# EAGLE design lcd13264-module-example (EAGLE 6.5.0)
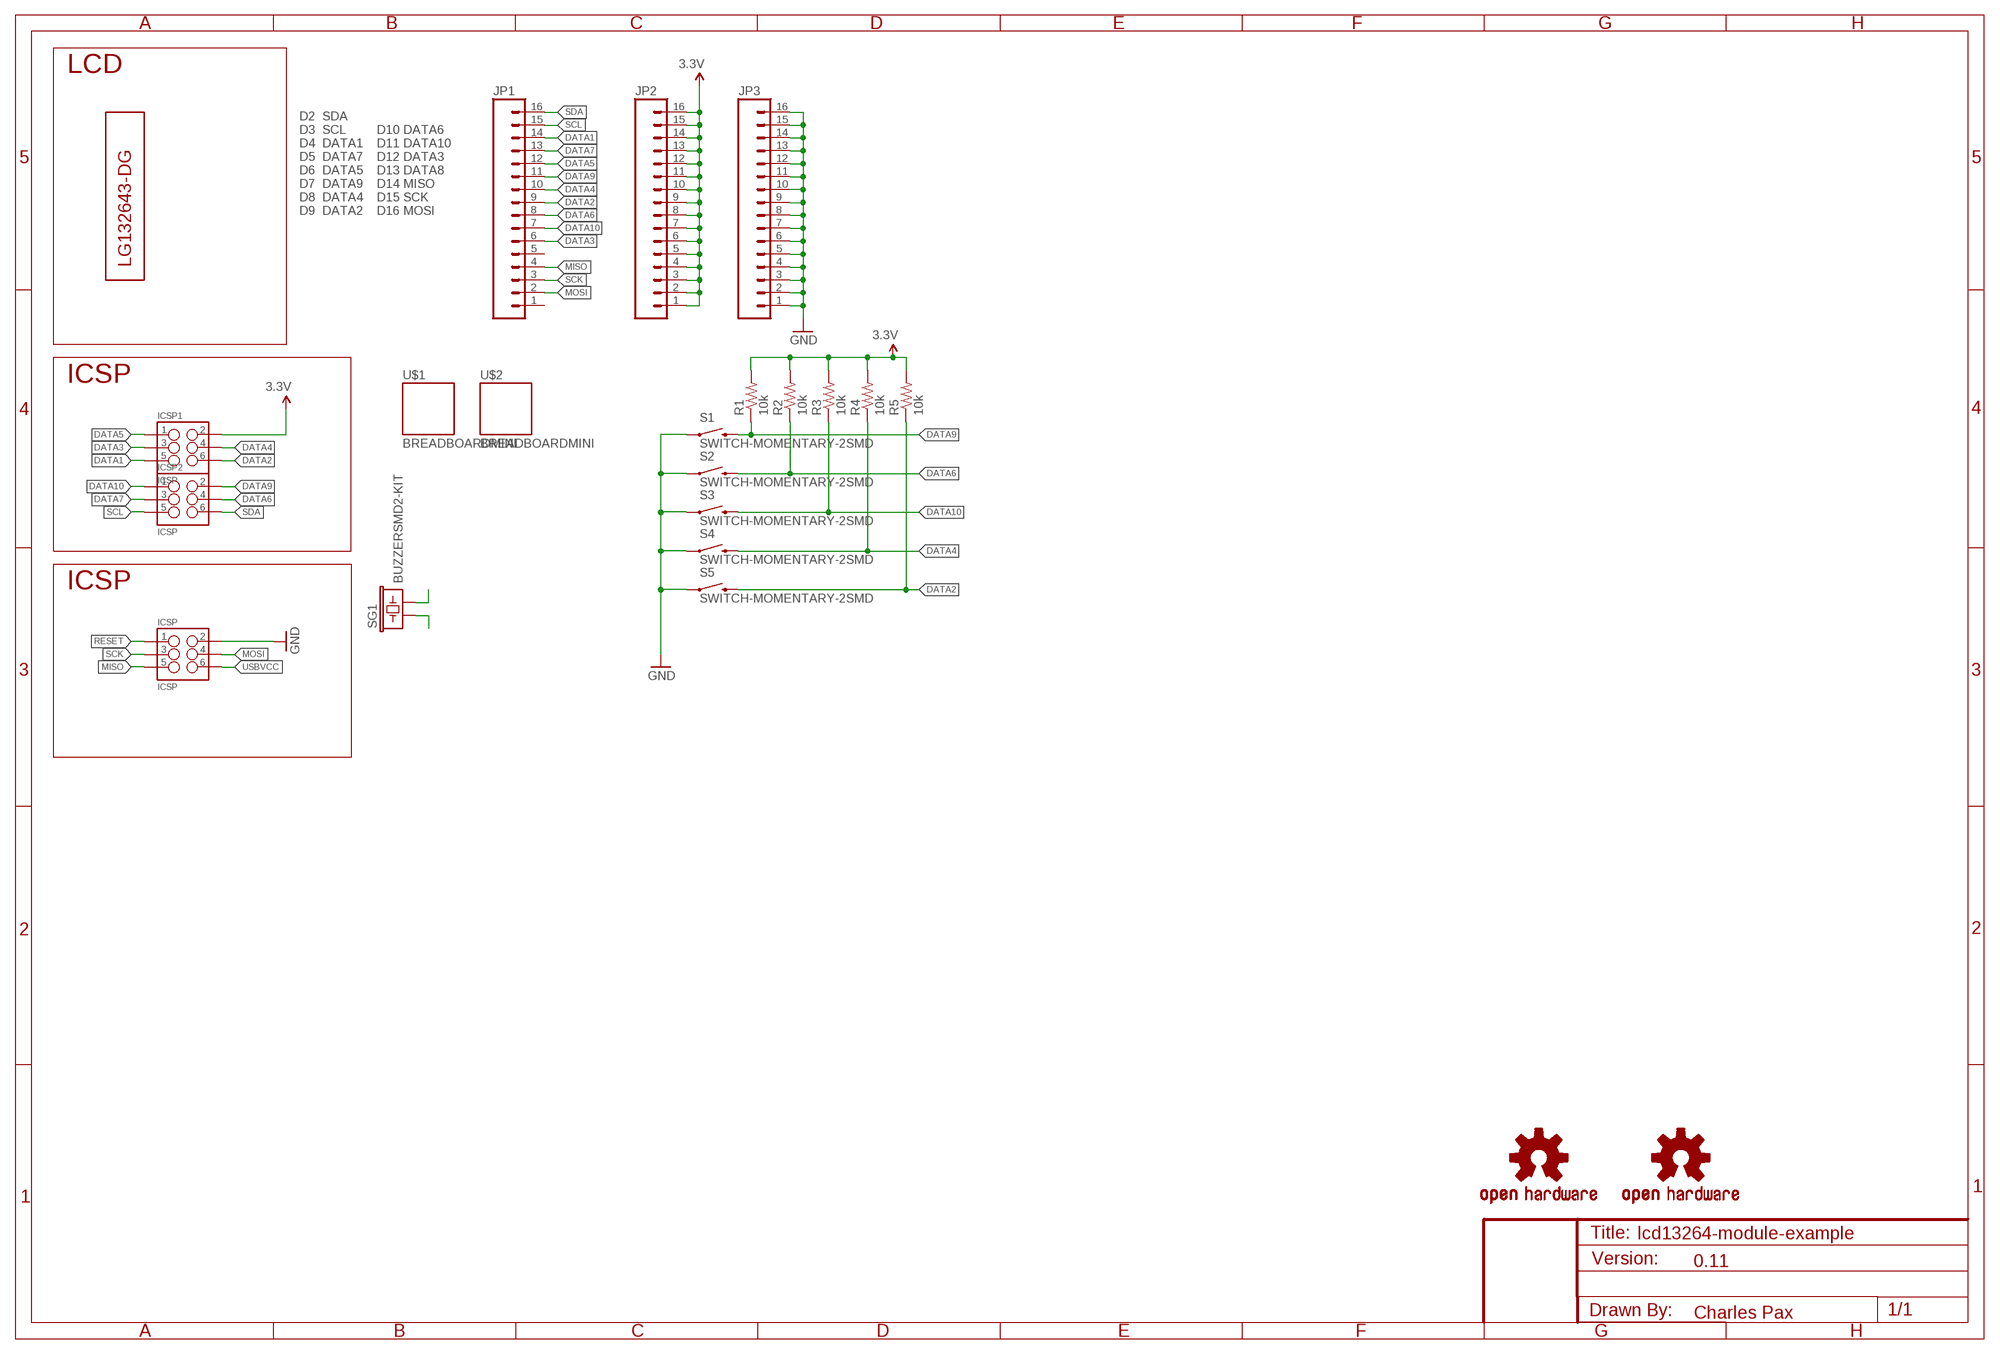
[diagram p0: schematic, sheet 1]

## Parts
ICSP  ICSP  SPARKFUN-CONNECTORS_M03X2PAX  [SPARKFUN-CONNECTORS_2X3_SMT_POSTS_PAXINSTRUMENT]
ICSP1  ICSP  SPARKFUN-CONNECTORS_M03X2PAX  [SPARKFUN-CONNECTORS_2X3_SMT_POSTS_PAXINSTRUMENT]
ICSP2  ICSP  SPARKFUN-CONNECTORS_M03X2PAX  [SPARKFUN-CONNECTORS_2X3_SMT_POSTS_PAXINSTRUMENT]
JP1  M161X16_NO_SILK  [1X16_NO_SILK]
JP2  M161X16_NO_SILK  [1X16_NO_SILK]
JP3  M161X16_NO_SILK  [1X16_NO_SILK]
LOGO1  OSHW-LOGOL  [OSHW-LOGO-L]
LOGO2  OSHW-LOGOL-COPPER  [OSHW-LOGO-L_COPPER]
R1  10k  RESISTOR0603-RES  [0603-RES]
R2  10k  RESISTOR0603-RES  [0603-RES]
R3  10k  RESISTOR0603-RES  [0603-RES]
R4  10k  RESISTOR0603-RES  [0603-RES]
R5  10k  RESISTOR0603-RES  [0603-RES]
S1  SWITCH-MOMENTARY-2SMD  [TACTILE-SWITCH-SMD]
S2  SWITCH-MOMENTARY-2SMD  [TACTILE-SWITCH-SMD]
S3  SWITCH-MOMENTARY-2SMD  [TACTILE-SWITCH-SMD]
S4  SWITCH-MOMENTARY-2SMD  [TACTILE-SWITCH-SMD]
S5  SWITCH-MOMENTARY-2SMD  [TACTILE-SWITCH-SMD]
SG1  BUZZERSMD2-KIT  [BUZZER-CCV-KIT]
U$1  BREADBOARDMINI  [BREADBOARD-MINI]
U$2  BREADBOARDMINI  [BREADBOARD-MINI]
U$5  LG132643-DG  [LG132643-DG]

## Nets
3.3V: ICSP1.2 JP2.1 JP2.2 JP2.3 JP2.4 JP2.5 JP2.6 JP2.7 JP2.8 JP2.9 JP2.10 JP2.11 JP2.12 JP2.13 JP2.14 JP2.15 JP2.16 R1.2 R2.2 R3.2 R4.2 R5.2
DATA1: ICSP1.5 JP1.14
DATA2: ICSP1.6 JP1.9 R5.1 S5.3
DATA3: ICSP1.3 JP1.6
DATA4: ICSP1.4 JP1.10 R4.1 S4.3
DATA5: ICSP1.1 JP1.12
DATA6: ICSP2.4 JP1.8 R2.1 S2.3
DATA7: ICSP2.3 JP1.13
DATA9: ICSP2.2 JP1.11 R1.1 S1.3
DATA10: ICSP2.1 JP1.7 R3.1 S3.3
GND: ICSP.2 JP3.1 JP3.2 JP3.3 JP3.4 JP3.5 JP3.6 JP3.7 JP3.8 JP3.9 JP3.10 JP3.11 JP3.12 JP3.13 JP3.14 JP3.15 JP3.16 S1.1 S2.1 S3.1 S4.1 S5.1
MISO: ICSP.5 JP1.4
MOSI: ICSP.4 JP1.2
N$1: SG1.+
N$2: SG1.-
RESET: ICSP.1
SCK: ICSP.3 JP1.3
SCL: ICSP2.5 JP1.15
SDA: ICSP2.6 JP1.16
USBVCC: ICSP.6
Unconnected: JP1.1 JP1.5

## Notes on the sheet
- LCD
- D2  SDA
  D3  SCL
  D4  DATA1
  D5  DATA7
  D6  DATA5
  D7  DATA9
  D8  DATA4
  D9  DATA2
- D10 DATA6
  D11 DATA10
  D12 DATA3
  D13 DATA8
  D14 MISO
  D15 SCK
  D16 MOSI
- ICSP
- ICSP
- 0.11
- Charles Pax

## Library data of the parts
ICSP ICSP1 ICSP2 = PaxInstrument-T400:SPARKFUN-CONNECTORS_M03X2: 2x3 .1" header. Shrouded, with keying- CONN-10681 SMT- CONN-11415 Pogo pins- HW-11044; MPN: 95278-101A06LF; OC_DIGIKEY: 609-3487-2-ND
JP1-JP3 = SparkFun-Connectors:M16: 1x16 .1" header
LOGO1 LOGO2 = SparkFun-Aesthetics:OSHW-LOGO: Open Source Hardware Logo This logo indicates the piece of hardware it is found on incorporates a OSHW license and/or adheres to the definition of open source hardware found here: http://freedomdefined.org/OSHW
R1-R5 = SparkFun-Passives:RESISTOR: Resistor Basic schematic elements and footprints for 0603, 1206, and PTH resistors.
S1-S5 = SparkFun-Electromechanical:SWITCH-MOMENTARY-2: Various NO switches- pushbuttons, reed, etc; PROD_ID: SWCH-08247
SG1 = SparkFun-Electromechanical:BUZZER: Buzzer 12mm Spark Fun Electronics SKU : Comp-Buzzer
U$1 U$2 = SparkFun-Boards:BREADBOARD: Breadboard Mini Self Adhesive This is the mechnical outline for the very small self adhesive breadboard from SparkFun Electronics. Good for very small proto areas. SKU : PRT-07916
U$5 = charlespax:LG132643-DG; MPN: LG132643-DW

## Net classes
0 default: width 0.203 mm, drill 0.33 mm
1 power: width 0.305 mm

## Board
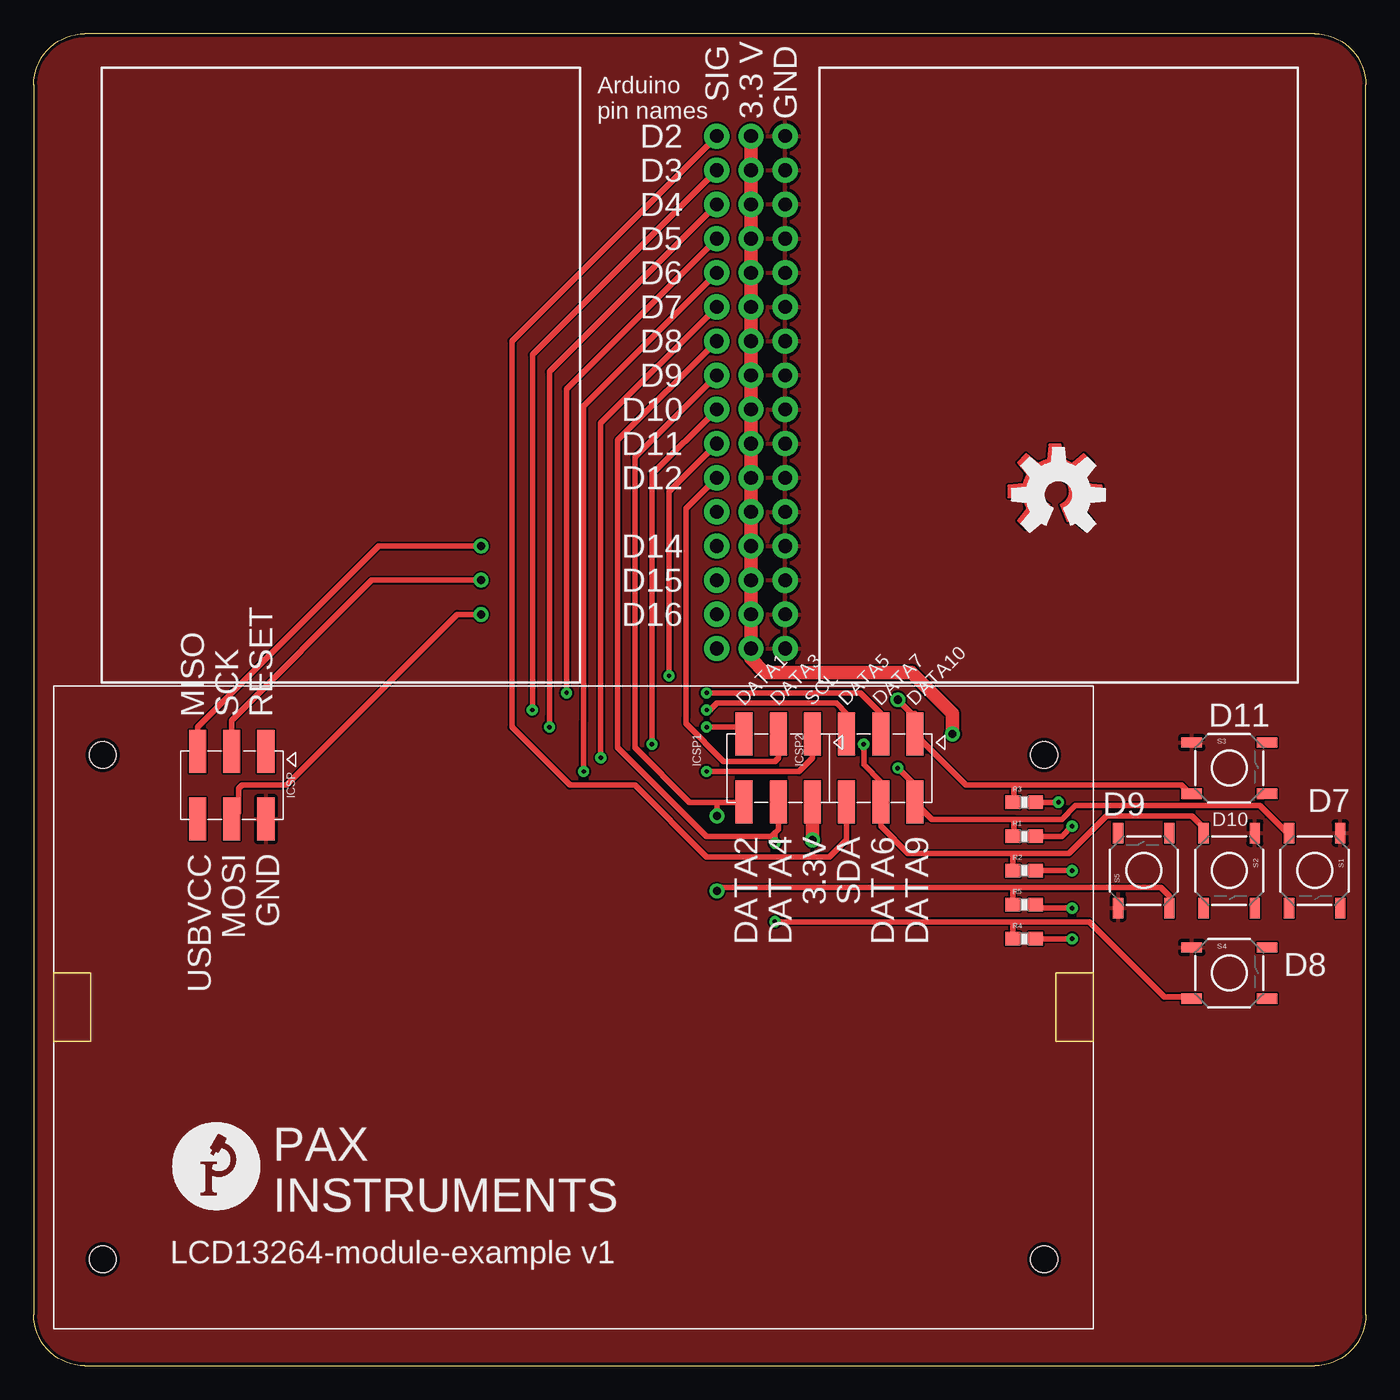
[diagram p1: board, top side]
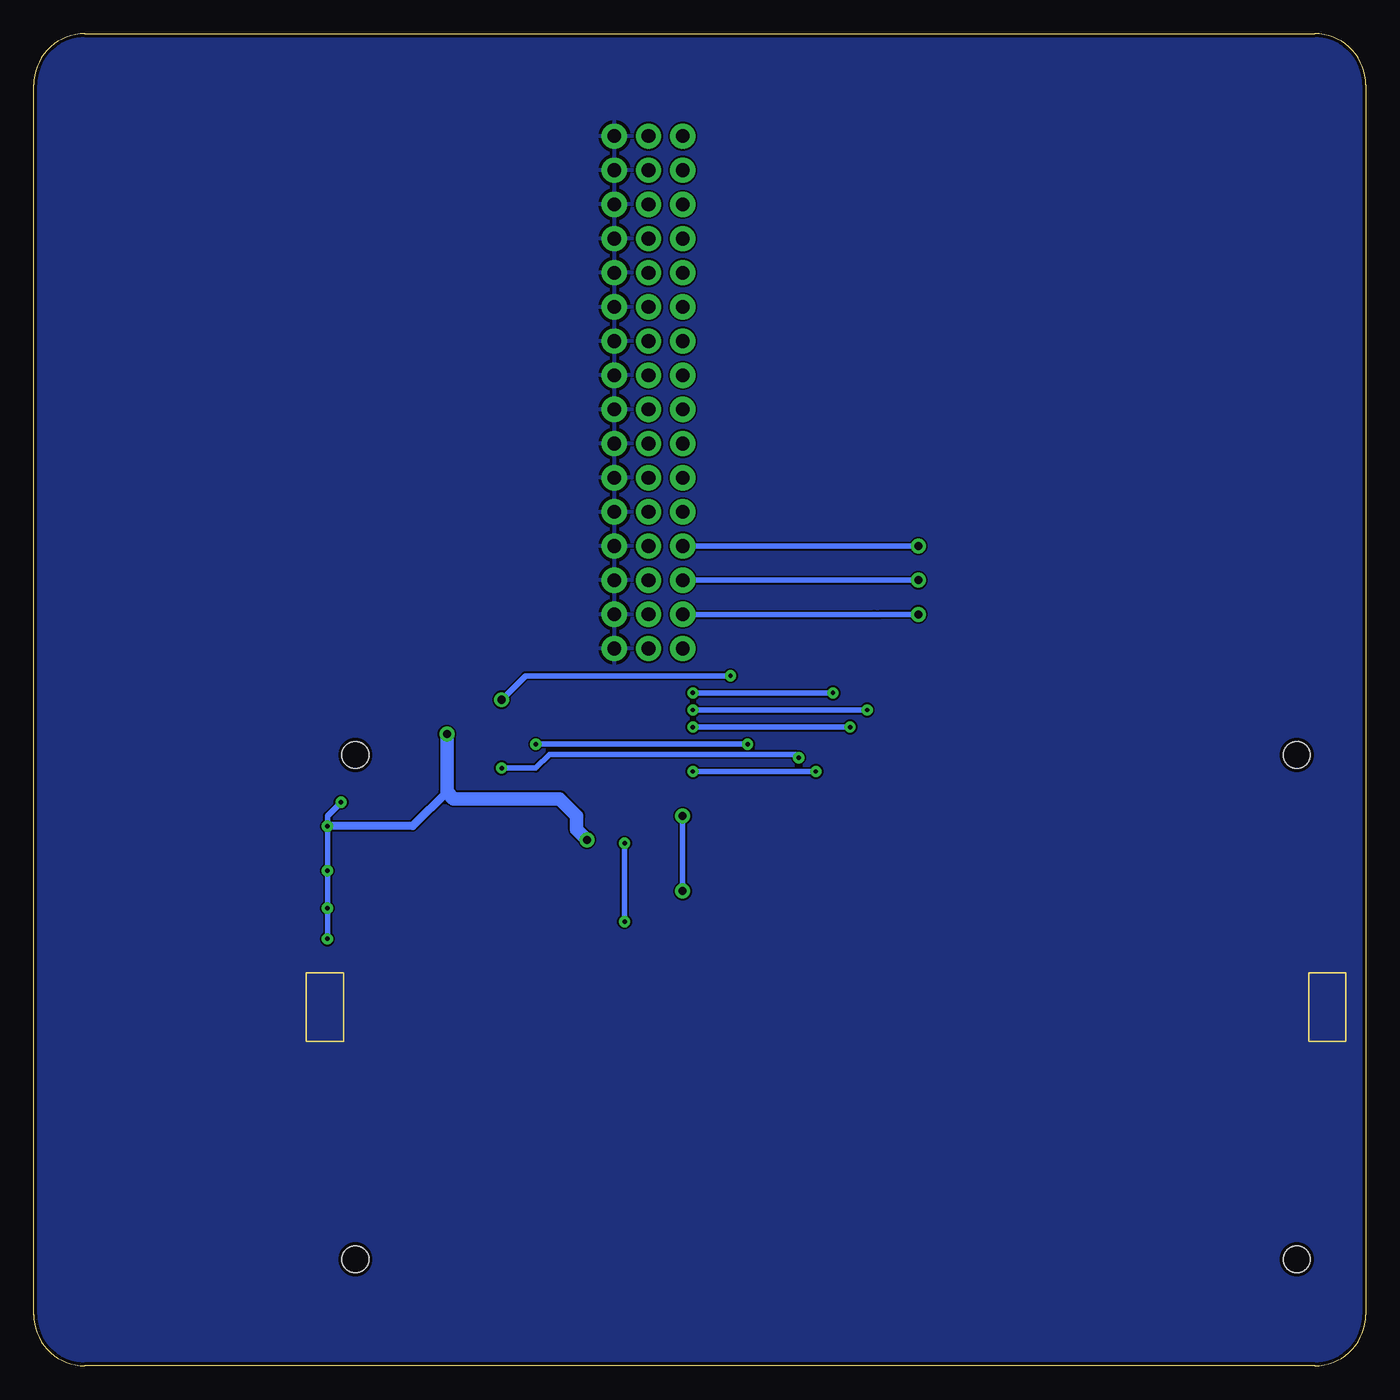
[diagram p2: board, bottom side, seen from below]

Size 99.06 x 99.06 mm. Coordinates in mm from the lower left corner, seen from the top.
Outline: 3.81,0 95.25,0 arc90 99.06,3.81 99.06,95.25 arc90 95.25,99.06 3.81,99.06 arc90 0,95.25 0,3.81 arc90 3.81,0
Copper layers (1*16): Top 0.035mm / dielectric 1.5mm / Bottom 0.035mm
Design rules "PaxInstrument-T400 *": minimum track width 6mil, minimum drill 13mil, track to track 5mil, track to pad 5mil, pad to pad 5mil, via to via 5mil, smd to smd 5mil, copper to edge 10mil, drill to drill 8mil, minimum pad ring 12mil, minimum via ring 10mil, stop-mask expansion 4mil, vias tented up to drill 25mil, thermal gap 10mil
vRestrict: area 1.3,2.5 to 78.7,50.8

### Footprints (pad centres in the part's own frame; a part is rotated, then mirrored left to right if it is on the bottom)
SPARKFUN-CONNECTORS_2X3_SMT_POSTS_PAXINSTRUMENT = smd 1.27 x 3.2: 1 -2.54,-2.52; 2 -2.54,2.52; 3 0,-2.52; 4 0,2.52; 5 2.54,-2.52; 6 2.54,2.52
1X16_NO_SILK = drill 1.016 pad 1.88: 1 0,0; 2 2.54,0; 3 5.08,0; 4 7.62,0; 5 10.16,0; 6 12.7,0; 7 15.24,0; 8 17.78,0; 9 20.32,0; 10 22.86,0; 11 25.4,0; 12 27.94,0; 13 30.48,0; 14 33.02,0; 15 35.56,0; 16 38.1,0
0603-RES = smd 1.1 x 1: 1 -0.85,0; 2 0.85,0
TACTILE-SWITCH-SMD = smd 1.524 x 0.762: 1 -2.794,1.905; 2 2.794,1.905; 3 -2.794,-1.905; 4 2.794,-1.905
BUZZER-CCV-KIT = smd 3.5 x 2: + 4.15,0; - -4.15,0 | hole 0.8: -3.9,-2.25; 2.25,3.9
LG132643-DG = hole 2: -35,-18.75; 35,-18.75; 35,18.75; -35,18.75

### Placement (x,y rotation side)
ICSP  14.73,43.18 180 top
ICSP1  55.37,44.45 180 top
ICSP2  62.99,44.45 180 top
JP1  50.8,53.34 90 top
JP2  53.34,53.34 90 top
JP3  55.88,53.34 90 top
LOGO1  76.2,64.77 0 top
LOGO2  75.95,65.02 0 top
R1  73.66,39.37 0 top
R2  73.66,36.83 0 top
R3  73.66,41.91 0 top
R4  73.66,31.75 0 top
R5  73.66,34.29 0 top
S1  95.25,36.83 270 top
S2  88.9,36.83 270 top
S3  88.9,44.45 0 top
S4  88.9,29.21 0 top
S5  82.55,36.83 90 top
SG1  -4.32,-17.27 0 top  (outside the outline)
U$1  93.98,50.8 90 top
U$2  40.64,50.8 90 top
U$5  40.13,26.67 0 bottom
U$6  [PAXINSTRUMENT_LOGO]  10.16,11.43 0 top

### Tracks (layer width: path | path; a pad name or v marks a point on that pad's centre or on a via)
3.3V  (via drill 0.33, 0.6)
  Top 0.406: v77.22,40.13 76.45,39.37 R1.2 | v77.22,34.04 74.76,34.04 R5.2 | R2.2 v77.22,36.83 | v77.22,31.75 R4.2 | R3.2 v76.2,41.91
  Top 1.016: JP2.16 JP2.15 JP2.14 JP2.13 JP2.12 JP2.11 JP2.10 JP2.9 JP2.8 JP2.7 JP2.6 JP2.5 JP2.4 JP2.3 JP2.2 JP2.1 53.34,52.58 54.36,51.56 65.28,51.56 68.33,48.51 v68.33,46.99 | ICSP1.2 v57.91,39.12
  Bottom 0.406: v77.22,31.75 v77.22,34.04 v77.22,36.83 v77.22,40.13 77.22,40.89 v76.2,41.91
  Bottom 0.61: 68.33,42.67 70.87,40.13 v77.22,40.13
  Bottom 1.016: v57.91,39.12 58.67,39.88 58.67,40.89 59.94,42.16 67.82,42.16 68.33,42.67 v68.33,46.99
DATA1  (via drill 0.33)
  Top 0.406: JP1.14 38.35,73.91 38.35,48.26 38.35,48.01 v38.35,47.5 | ICSP1.5 52.3,47.5 v50.04,47.5
  Bottom 0.406: v50.04,47.5 v38.35,47.5
DATA2  (via drill 0.6)
  Top 0.406: JP1.9 44.7,67.56 44.7,45.97 48.77,41.91 50.8,41.91 | ICSP1.6 52.81,41.91 50.8,41.91 | 50.8,41.91 v50.8,40.89 | v50.8,35.31 51.05,35.56 72.9,35.56 | 72.9,35.56 83.82,35.56 84.45,34.92 S5.3 | R5.1 72.81,35.47 72.9,35.56
  Bottom 0.406: v50.8,40.89 v50.8,35.31
DATA3
  Top 0.406: JP1.6 48.51,63.75 48.51,48.77 48.51,48.26 48.51,47.75 51.31,44.96 55.12,44.96 55.37,45.21 ICSP1.3
DATA4  (via drill 0.33)
  Top 0.406: JP1.10 43.43,68.83 43.43,45.97 50.04,39.37 54.86,39.37 54.99,39.5 | ICSP1.4 55.37,39.88 54.99,39.5 | R4.1 72.81,33.02 | 72.81,33.02 v55.12,33.02 | v55.12,38.86 55.12,39.5 54.99,39.5 | S4.3 85.98,27.43 84.07,27.43 78.49,33.02 72.81,33.02
  Bottom 0.406: v55.12,33.02 v55.12,38.86
DATA5  (via drill 0.33)
  Top 0.406: JP1.12 40.89,71.37 40.89,48.26 40.89,48.01 v40.89,44.2 | ICSP1.1 57.91,45.21 56.9,44.2 v50.04,44.2
  Bottom 0.406: v50.04,44.2 v40.89,44.2
DATA6  (via drill 0.33)
  Top 0.406: JP1.8 45.97,66.29 v45.97,46.23 | v61.72,46.23 61.72,44.7 62.99,43.43 ICSP2.4 62.99,40.13 65.02,38.1 72.9,38.1 | 72.9,38.1 76.96,38.1 79.76,40.89 86.11,40.89 87,40.01 S2.3 | R2.1 72.81,38.01 72.9,38.1
  Bottom 0.406: v45.97,46.23 v61.72,46.23
DATA7  (via drill 0.33)
  Top 0.406: JP1.13 39.62,72.64 v39.62,50.04 | ICSP2.3 62.99,48.51 61.47,50.04 v50.04,50.04
  Bottom 0.406: v50.04,50.04 v39.62,50.04
DATA9  (via drill 0.33)
  Top 0.406: JP1.11 42.16,70.1 v42.16,45.21 | v64.26,44.45 65.53,43.18 ICSP2.2 | ICSP2.2 65.81,41.66 | S1.3 93.22,39.62 91.19,41.66 77.47,41.66 76.45,40.64 72.9,40.64 | R1.1 72.9,39.46 72.9,40.64 | 72.9,40.64 66.8,40.64 65.53,41.91 ICSP2.2
  Bottom 0.406: v42.16,45.21 42.42,45.47 60.71,45.47 61.72,44.45 v64.26,44.45
DATA10  (via drill 0.33, 0.6)
  Top 0.406: JP1.7 47.24,65.02 v47.24,51.31 | 65.53,48.26 65.53,48.51 | v64.26,49.53 65.53,48.26 | 65.53,48.26 ICSP2.1 69.32,43.18 72.9,43.18 | 72.9,43.18 85.34,43.18 85.98,42.55 S3.3 | R3.1 72.9,42 72.9,43.18
  Bottom 0.406: v47.24,51.31 62.48,51.31 v64.26,49.53
GND
  pour Top: 0,99.06 0,0 99.06,0 99.06,99.06
  pour Bottom: 0,99.06 0,0 99.06,0 99.06,99.06
MISO  (via drill 0.6)
  Top 0.406: ICSP.5 12.19,47.5 25.65,60.96 v33.27,60.96
  Bottom 0.406: JP1.4 v33.27,60.96
MOSI  (via drill 0.6)
  Top 0.406: ICSP.4 15.24,41.17 15.24,42.93 15.49,43.18 18.8,43.18 31.5,55.88 v33.27,55.88
  Bottom 0.406: JP1.2 36.58,55.88 36.07,55.88 v33.27,55.88
SCK  (via drill 0.6)
  Top 0.406: v33.27,58.42 28.19,58.42 27.45,58.42 25.15,58.42 14.73,48.01 ICSP.3
  Bottom 0.406: JP1.3 v33.27,58.42
SCL  (via drill 0.33)
  Top 0.406: JP1.15 37.08,75.18 v37.08,48.77 | ICSP2.5 60.45,48.51 59.69,49.28 50.8,49.28 50.29,48.77 v50.04,48.77
  Bottom 0.406: v50.04,48.77 v37.08,48.77
SDA
  Top 0.406: JP1.16 35.56,76.2 35.56,47.5 39.88,43.18 44.7,43.18 50.04,37.85 59.18,37.85 60.45,39.12 ICSP2.6

### Text on the board
tPlace: SIG | Arduino / pin names | 3.3 V | GND | D2 | D3 | D4 | D5 | D6 | D7 | D8 | D9 | D10 | D11 | D12 | D14 | D15 | D16 | DATA1 | DATA3 | SCL | DATA5 | DATA7 | DATA10 | MISO | SCK | RESET | D11 | D9 | D7 | D10 | DATA2 | DATA4 | 3.3V | SDA | DATA6 | DATA9 | USBVCC | MOSI | GND | D8 | PAX / INSTRUMENTS | LCD13264-module-example v1